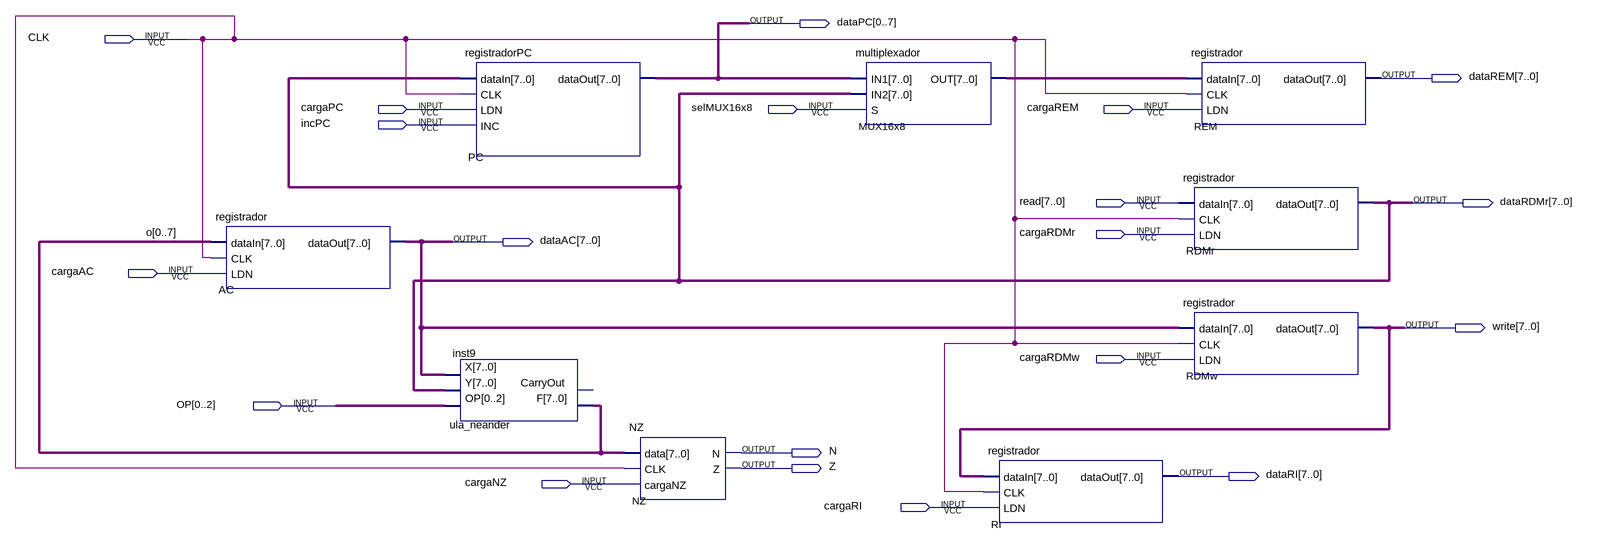
[diagram p0: schematic sheet]
// Quartus schematic neander_datapath.bdf as structural Verilog: 9 symbols, 20 pins
module neander_datapath (
  input  CLK,
  input  cargaPC,
  input  selMUX16x8,
  input  cargaREM,
  input  incPC,
  input  [7:0] read,
  input  cargaRDMr,
  input  cargaAC,
  input  cargaRDMw,
  input  [0:2] OP,
  input  cargaNZ,
  input  cargaRI,
  output [0:7] dataPC,
  output [7:0] dataREM,
  output [7:0] dataRDMr,
  output [7:0] dataAC,
  output [7:0] write,
  output N,
  output Z,
  output [7:0] dataRI
);

  wire [7:0] MUX16x8_out, o;

  registrador AC (
    .dataIn({o[0], o[1], o[2], o[3], o[4], o[5], o[6], o[7]}), .CLK(CLK), .LDN(cargaAC), .dataOut(dataAC));
  registradorPC PC (.dataIn(dataRDMr), .CLK(CLK), .LDN(cargaPC), .INC(incPC), .dataOut(dataPC));
  ula_neander inst9 (
    .OP(OP), .Y(dataRDMr), .X(dataAC), .F({o[0], o[1], o[2], o[3], o[4], o[5], o[6], o[7]}));  // open: CarryOut
  NZ NZ (.data({o[0], o[1], o[2], o[3], o[4], o[5], o[6], o[7]}), .CLK(CLK), .cargaNZ(cargaNZ), .N(N), .Z(Z));
  multiplexador MUX16x8 (.IN1(dataPC), .IN2(dataRDMr), .S(selMUX16x8), .OUT(MUX16x8_out));
  registrador RI (.dataIn(write), .CLK(CLK), .LDN(cargaRI), .dataOut(dataRI));
  registrador REM (.dataIn(MUX16x8_out), .CLK(CLK), .LDN(cargaREM), .dataOut(dataREM));
  registrador RDMr (.dataIn(read), .CLK(CLK), .LDN(cargaRDMr), .dataOut(dataRDMr));
  registrador RDMw (.dataIn(dataAC), .CLK(CLK), .LDN(cargaRDMw), .dataOut(write));
endmodule
